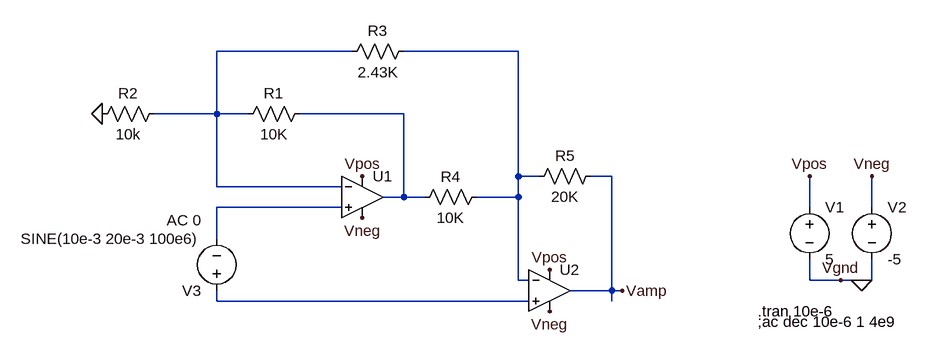
[diagram p0: schematic Draft1.asc]
Draft1.asc, the LTspice schematic file:
Version 4
SHEET 1 1380 752
WIRE 176 -304 -32 -304
WIRE 432 -304 256 -304
WIRE -32 -208 -32 -304
WIRE -32 -208 -128 -208
WIRE 16 -208 -32 -208
WIRE 256 -208 96 -208
WIRE 432 -112 432 -304
WIRE 464 -112 432 -112
WIRE 576 -112 544 -112
WIRE -32 -96 -32 -208
WIRE 160 -96 -32 -96
WIRE 256 -80 256 -208
WIRE 256 -80 224 -80
WIRE 288 -80 256 -80
WIRE 432 -80 432 -112
WIRE 432 -80 368 -80
WIRE 160 -64 -32 -64
WIRE 880 -64 880 -112
WIRE 976 -64 976 -112
WIRE -32 -16 -32 -64
WIRE 432 48 432 -80
WIRE 448 48 432 48
WIRE 880 48 880 16
WIRE 928 48 880 48
WIRE 960 48 928 48
WIRE 976 48 976 16
WIRE 976 48 960 48
WIRE 576 64 576 -112
WIRE 576 64 512 64
WIRE 592 64 576 64
WIRE -32 80 -32 64
WIRE 448 80 -32 80
WIRE 576 80 576 64
FLAG 880 -112 Vpos
FLAG 976 -112 Vneg
FLAG 928 48 Vgnd
FLAG 192 -112 Vpos
FLAG 480 32 Vpos
FLAG 192 -48 Vneg
FLAG 480 96 Vneg
FLAG 592 64 Vamp
FLAG 960 48 0
FLAG -208 -208 0
SYMBOL voltage 880 -80 R0
WINDOW 123 0 0 Left 0
WINDOW 39 0 0 Left 0
SYMATTR InstName V1
SYMATTR Value 5
SYMBOL voltage 976 -80 R0
WINDOW 123 0 0 Left 0
WINDOW 39 0 0 Left 0
SYMATTR InstName V2
SYMATTR Value -5
SYMBOL voltage -32 80 R180
WINDOW 123 24 124 Left 2
WINDOW 39 0 0 Left 0
SYMATTR Value2 AC 0
SYMATTR InstName V3
SYMATTR Value SINE(10e-3 20e-3 100e6)
SYMBOL Opamps\\UniversalOpamp2 192 -80 R0
SYMATTR InstName U1
SYMATTR Value2 Avol=31.6228k GBW=3900Meg Slew=950Meg
SYMBOL Opamps\\UniversalOpamp2 480 64 R0
SYMATTR InstName U2
SYMATTR Value2 Avol=31.6228k GBW=3900Meg Slew=950Meg
SYMBOL res 112 -224 R90
WINDOW 0 0 56 VBottom 2
WINDOW 3 32 56 VTop 2
SYMATTR InstName R1
SYMATTR Value 10K
SYMBOL res -112 -224 R90
WINDOW 0 0 56 VBottom 2
WINDOW 3 32 56 VTop 2
SYMATTR InstName R2
SYMATTR Value 10k
SYMBOL res 272 -320 R90
WINDOW 0 0 56 VBottom 2
WINDOW 3 32 56 VTop 2
SYMATTR InstName R3
SYMATTR Value 2.43K
SYMBOL res 384 -96 R90
WINDOW 0 0 56 VBottom 2
WINDOW 3 32 56 VTop 2
SYMATTR InstName R4
SYMATTR Value 10K
SYMBOL res 560 -128 R90
WINDOW 0 0 56 VBottom 2
WINDOW 3 32 56 VTop 2
SYMATTR InstName R5
SYMATTR Value 20K
TEXT 800 96 Left 2 !.tran 10e-6
TEXT 800 112 Left 2 !;ac dec 10e-6 1 4e9

The netlist it stands for:
* Draft1.asc
V1 Vpos 0 5
V2 Vneg 0 -5
V3 N005 N004 SINE(10e-3 20e-3 100e6) AC 0
XU1 N004 N001 Vpos Vneg N003 level.2 Avol=31.6228k GBW=3900Meg Slew=950Meg ilimit=25m rail=0 Vos=0 phimargin=45 en=0 enk=0 in=0 ink=0 Rin=500Meg  ; pins IN+ IN- V+ V- OUT
XU2 N005 N002 Vpos Vneg Vamp level.2 Avol=31.6228k GBW=3900Meg Slew=950Meg ilimit=25m rail=0 Vos=0 phimargin=45 en=0 enk=0 in=0 ink=0 Rin=500Meg  ; pins IN+ IN- V+ V- OUT
R1 N003 N001 10K
R2 N001 0 10k
R3 N002 N001 2.43K
R4 N002 N003 10K
R5 Vamp N002 20K
.tran 10e-6
;ac dec 10e-6 1 4e9
.lib UniversalOpamps2.sub
.backanno
.end